# EAGLE design Project a Sketch (EAGLE 5.11)
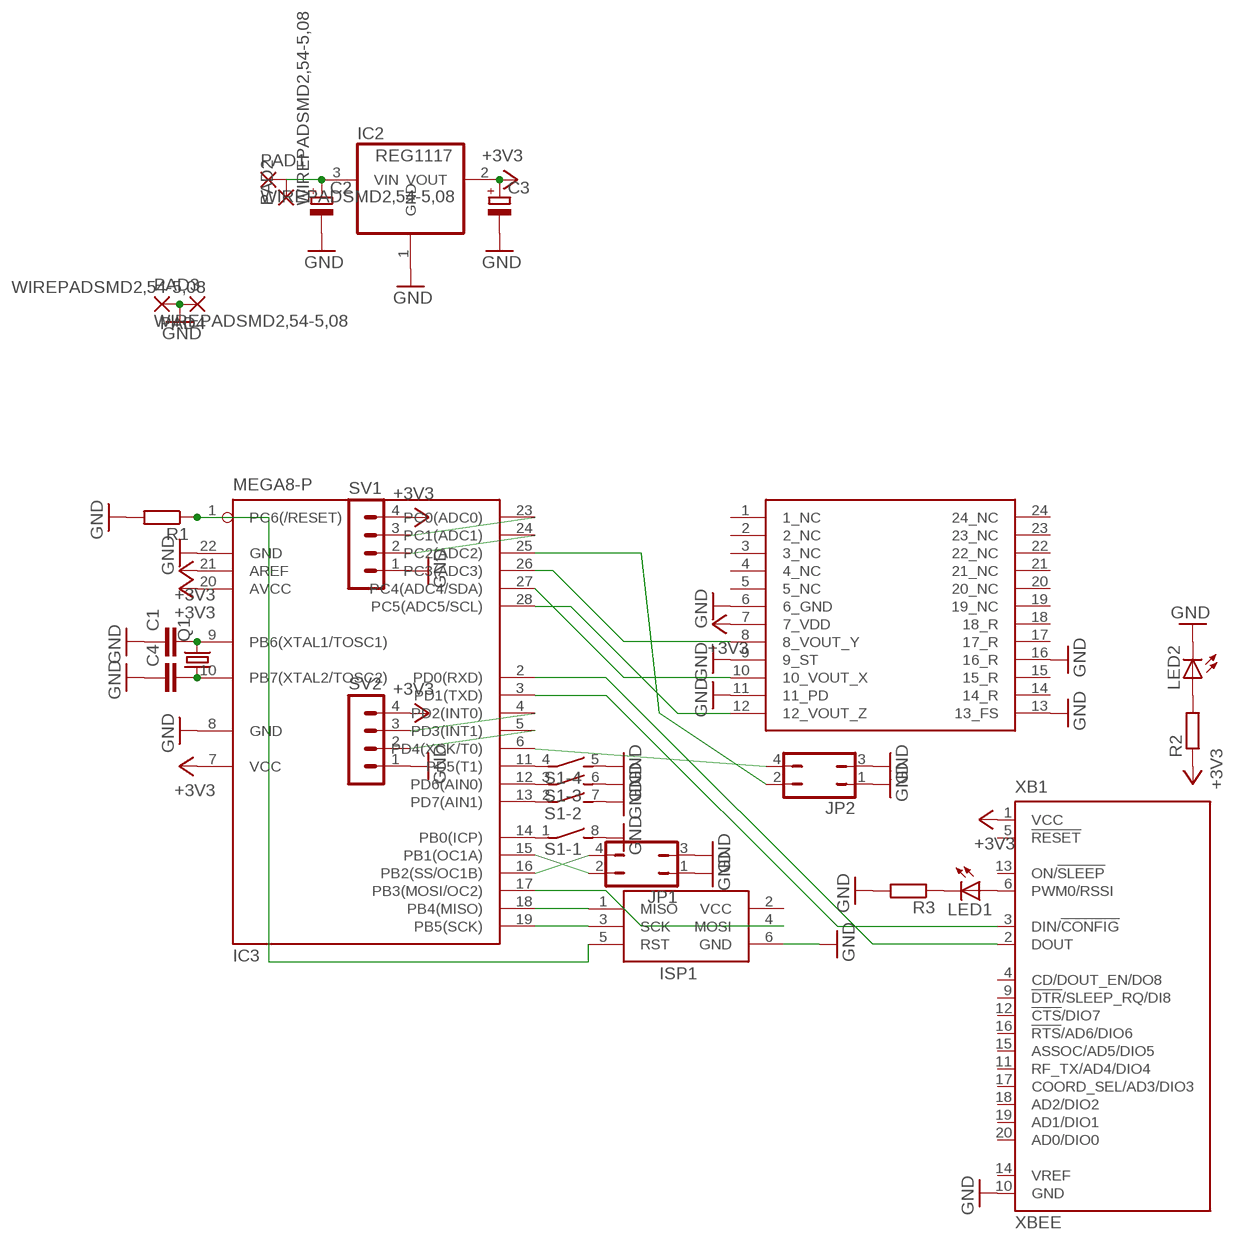
[diagram p0: schematic, sheet 1]

## Parts
C1  C-EUC0805K  [C0805K]
C2  CPOL-EUE5-6  [E5-6]
C3  CPOL-EUE5-6  [E5-6]
C4  C-EUC0805K  [C0805K]
IC2  REG1117  [SOT223]
IC3  MEGA8-P  [DIL28-3]
ISP1  AVRISP-6  [AVRISP]
JP1  JP2Q  [JP2Q]
JP2  JP2Q  [JP2Q]
LED1  LEDCHIPLED_1206  [CHIPLED_1206]
LED2  LEDCHIPLED_1206  [CHIPLED_1206]
PAD1  WIREPADSMD2,54-5,08  [SMD2,54-5,08]
PAD2  WIREPADSMD2,54-5,08  [SMD2,54-5,08]
PAD3  WIREPADSMD2,54-5,08  [SMD2,54-5,08]
PAD4  WIREPADSMD2,54-5,08  [SMD2,54-5,08]
Q1  CRYSTALHC49S  [HC49/S]
R1  R-EU_R0805  [R0805]
R2  R-EU_R0805  [R0805]
R3  R-EU_R0805  [R0805]
S1  DIP04S  [DIP04S]
SV1  MA04-1  [MA04-1]
SV2  MA04-1  [MA04-1]
U$1  LIS3L02AS4  [SO-24]
XB1  XBEE  [XBEE]

## Nets
+3V3: C3.+ IC2.2(VOUT) IC3.7(VCC) IC3.20(AVCC) IC3.21(AREF) R2.1 SV1.4 SV2.4 U$1.7(7_VDD) XB1.1(VCC)
GND: C1.1 C2.- C3.- C4.1 IC2.1(GND) IC3.8(GND) IC3.22(GND) ISP1.6(GND) JP1.1 JP1.3 JP2.1 JP2.3 LED2.C PAD3.1(P) PAD4.1(P) R1.2 R3.2 S1.5 S1.6 S1.7 S1.8 SV1.1 SV2.1 U$1.6(6_GND) U$1.9(9_ST) U$1.11(11_PD) U$1.13(13_FS) U$1.16(16_R) XB1.10(GND)
N$1: IC3.1(PC6(/RESET)) ISP1.5(RST) R1.1
N$2: IC3.18(PB4(MISO)) ISP1.1(MISO)
N$3: IC3.19(PB5(SCK)) ISP1.3(SCK)
N$4: IC3.17(PB3(MOSI/OC2)) ISP1.4(MOSI)
N$5: C1.2 IC3.9(PB6(XTAL1/TOSC1)) Q1.2
N$6: C2.+ IC2.3(VIN) PAD1.1(P) PAD2.1(P)
N$7: IC3.27(PC4(ADC4/SDA)) U$1.10(10_VOUT_X)
N$8: IC3.28(PC5(ADC5/SCL)) U$1.12(12_VOUT_Z)
N$9: IC3.26(PC3(ADC3)) U$1.8(8_VOUT_Y)
N$10: IC3.2(PD0(RXD)) XB1.2(DOUT)
N$11: IC3.3(PD1(TXD)) XB1.3(DIN/!CONFIG)
N$12: IC3.11(PD5(T1)) S1.4
N$13: IC3.13(PD7(AIN1)) S1.2
N$14: IC3.12(PD6(AIN0)) S1.3
N$15: IC3.14(PB0(ICP)) S1.1
N$16: C4.2 IC3.10(PB7(XTAL2/TOSC2)) Q1.1
N$17: IC3.4(PD2(INT0)) SV2.3
N$18: IC3.5(PD3(INT1)) SV2.2
N$19: IC3.23(PC0(ADC0)) SV1.3
N$20: IC3.24(PC1(ADC1)) SV1.2
N$21: IC3.16(PB2(SS/OC1B)) JP1.4
N$22: IC3.15(PB1(OC1A)) JP1.2
N$23: IC3.6(PD4(XCK/T0)) JP2.4
N$24: IC3.25(PC2(ADC2)) JP2.2
N$25: LED1.A XB1.6(PWM0/RSSI)
N$26: LED2.A R2.2
N$27: LED1.C R3.1
Unconnected: U$1.1(1_NC) U$1.2(2_NC) U$1.3(3_NC) U$1.4(4_NC) U$1.5(5_NC) U$1.14(14_R) U$1.15(15_R) U$1.17(17_R) U$1.18(18_R) U$1.19(19_NC) U$1.20(20_NC) U$1.21(21_NC) U$1.22(22_NC) U$1.23(23_NC) U$1.24(24_NC) XB1.4(CD/DOUT_EN/DO8) XB1.5(!RESET) XB1.9(!DTR!/SLEEP_RQ/DI8) XB1.11(RF_TX/AD4/DIO4) XB1.12(!CTS!/DIO7) XB1.13(ON/!SLEEP) XB1.14(VREF) XB1.15(ASSOC/AD5/DIO5) XB1.16(!RTS!/AD6/DIO6) XB1.17(COORD_SEL/AD3/DIO3) XB1.18(AD2/DIO2) XB1.19(AD1/DIO1) XB1.20(AD0/DIO0)

## Power pins joined to a net without a drawn wire
VCC: ISP1.2(VCC)

## Library data of the parts
C1 C4 = rcl:C-EU: CAPACITOR, European symbol
C2 C3 = rcl:CPOL-EU: POLARIZED CAPACITOR, European symbol
IC2 = burr-brown:REG1117: 800mA and 1A Low Dropout (LDO) Positive Regulator 1.8V, 2.5V, 2.85V, 3.3V, 5V, and Adj; MPN: REG1117; OC_FARNELL: 1097566; OC_NEWARK: 14P6981
IC3 = atmel:MEGA8-P: MICROCONTROLLER 8 Kbytes FLASH, 1 kbytes SRAM, 512 bytes EEPROM, USART, 4-channel 10 bit ADC, 2-channel 8 bit ADC Pin compatible with Atmega48, ATMega88, ATMega168 Source: avr.lbr; OC_FARNELL: unknown; OC_NEWARK: unknown
ISP1 = adafruit:AVRISP: AVR ISP HEADER Standard 6 pin header for AVR programming
JP1 JP2 = jumper:JP2Q: JUMPER
LED1 LED2 = led:LED: LED OSRAM: - CHIPLED LG R971, LG N971, LY N971, LG Q971, LY Q971, LO R971, LY R971 LH N974, LH R974 LS Q976, LO Q976, LY Q976 LO Q996 - Hyper CHIPLED LW Q18S LB Q993, LB Q99A, LB R99A - SideLED LS A670, LO A670, LY A670, LG A670, LP A670 LB A673, LV A673, LT A673, LW A673 LH A674 LY A675 LS A676, LA A676, LO A676, LY A676, LW A676 LS A679, LY A679, LG A679 - Hyper Micro SIDELED® LS Y876, LA Y876, LO Y876, LY Y876 LT Y87S - SmartLED LW L88C, LW L88S LB L89C, LB L89S, LG L890 LS L89K, LO L89K, LY L89K LS L896, LA L896, LO L896, LY L896 - TOPLED LS T670, LO T670, LY T670, LG T670, LP T670 LSG T670, LSP T670, LSY T670, LOP T670, LYG T670 LG T671, LOG T671, LSG T671 LB T673, LV T673, LT T673, LW T673 LH T674 LS T676, LA T676, LO T676, LY T676, LB T676, LH T676, LSB T676, LW T676 LB T67C, LV T67C, LT T67C, LS T67K, LO T67K, LY T67K, LW E67C LS E67B, LA E67B, LO E67B, LY E67B, LB E67C, LV E67C, LT E67C LW T67C LS T679, LY T679, LG T679 LS T770, LO T770, LY T770, LG T770, LP T770 LB T773, LV T773, LT T773, LW T773 LH T774 LS E675, LA E675, LY E675, LS T675 LS T776, LA T776, LO T776, LY T776, LB T776 LHGB T686 LT T68C, LB T68C - Hyper Mini TOPLED® LB M676 - Mini TOPLED Santana® LG M470 LS M47K, LO M47K, LY M47K Source: http://www.osram.convergy.de LUXEON: - LUMILED® LXK2-PW12-R00, LXK2-PW12-S00, LXK2-PW14-U00, LXK2-PW14-V00 LXK2-PM12-R00, LXK2-PM12-S00, LXK2-PM14-U00 LXK2-PE12-Q00, LXK2-PE12-R00, LXK2-PE12-S00, LXK2-PE14-T00, LXK2-PE14-U00 LXK2-PB12-K00, LXK2-PB12-L00, LXK2-PB12-M00, LXK2-PB14-N00, LXK2-PB14-P00, LXK2-PB14-Q00 LXK2-PR12-L00, LXK2-PR12-M00, LXK2-PR14-Q00, LXK2-PR14-R00 LXK2-PD12-Q00, LXK2-PD12-R00, LXK2-PD12-S00 LXK2-PH12-R00, LXK2-PH12-S00 LXK2-PL12-P00, LXK2-PL12-Q00, LXK2-PL12-R00 Source: www.luxeon.com KINGBRIGHT: KA-3528ASYC Source: www.kingbright.com
PAD1-PAD4 = wirepad:WIREPAD: Wire PAD connect wire on PCB
Q1 = crystal:CRYSTAL: CRYSTAL; OC_FARNELL: 1667008; OC_NEWARK: unknown
R1-R3 = rcl:R-EU_: RESISTOR, European symbol
S1 = switch-dil:DIP04S: DIL/CODE SWITCH; OC_FARNELL: unknown; OC_NEWARK: unknown
SV1 SV2 = con-lstb:MA04-1: PIN HEADER; OC_FARNELL: unknown; OC_NEWARK: unknown
U$1 = lis3l02as4:LIS3L02AS4: www.st.com 3-axis-accelerometer
XB1 = maxstream:XBEE: XBee (TM) /XBee-PRO(TM) OEM RF Modules Source: MaxStream, Inc. xbee_productmanual.pdf; MPN: XBP24-Z7UIT-004; OC_FARNELL: 1751799; OC_NEWARK: 34R5507

## Board
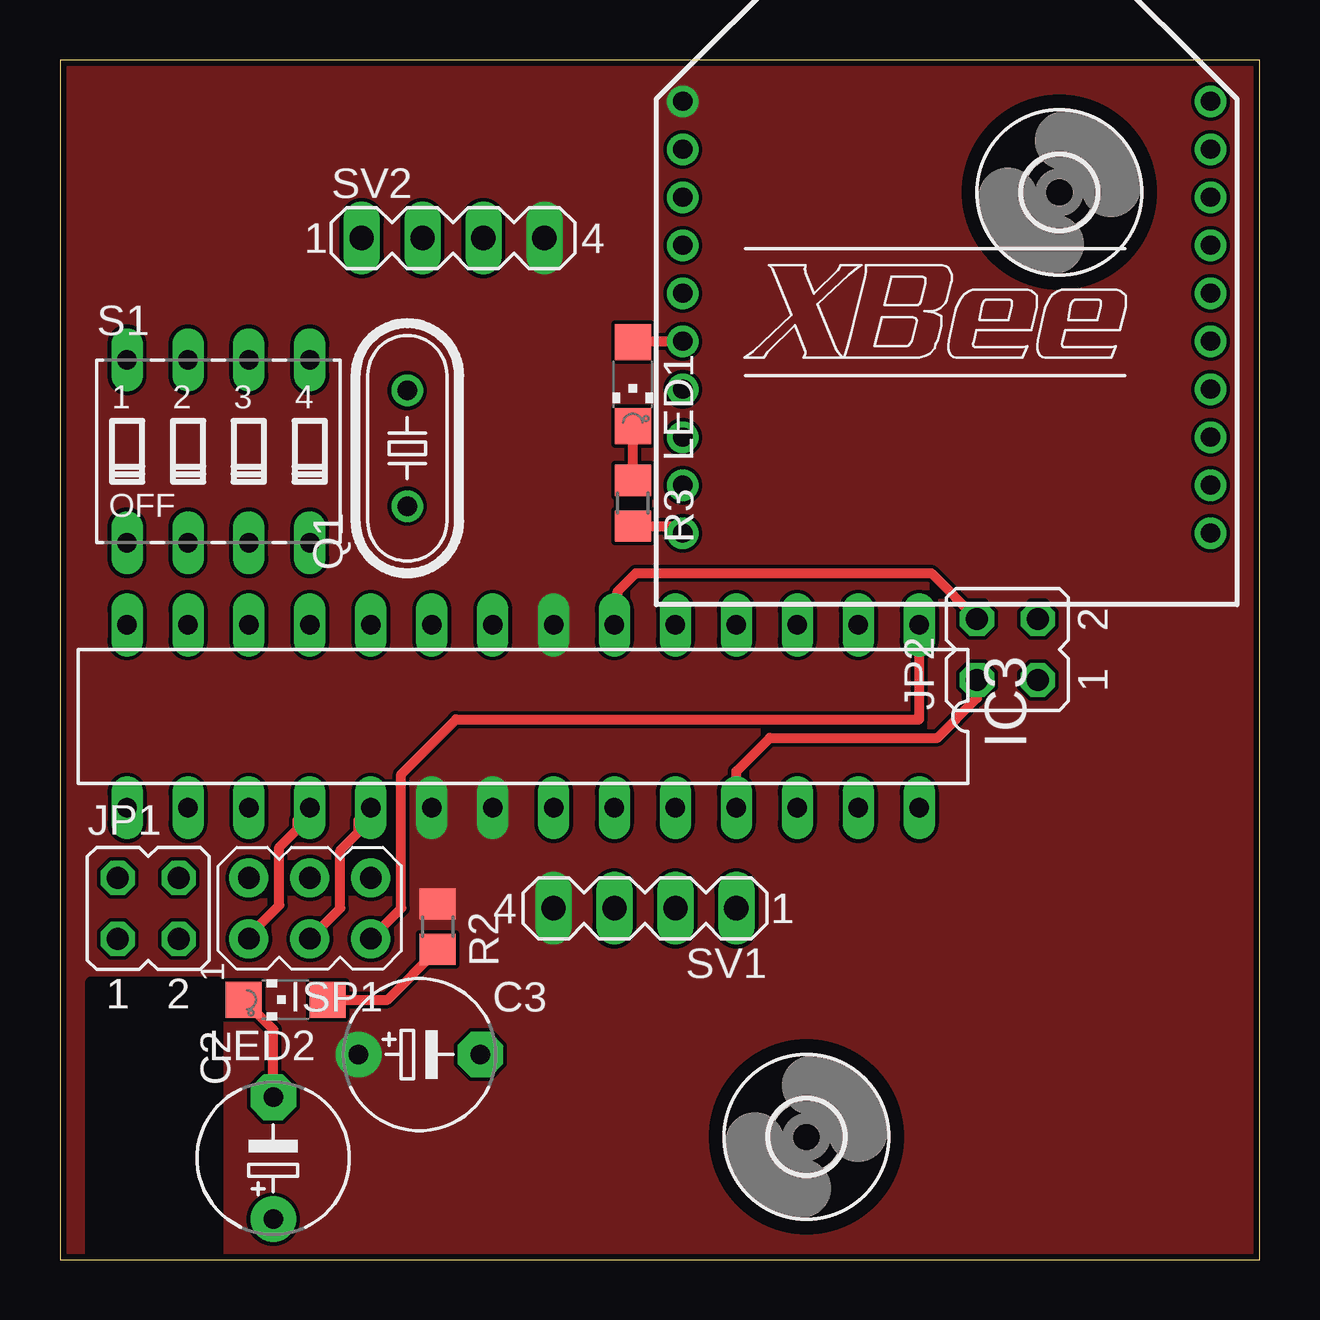
[diagram p1: board, top side]
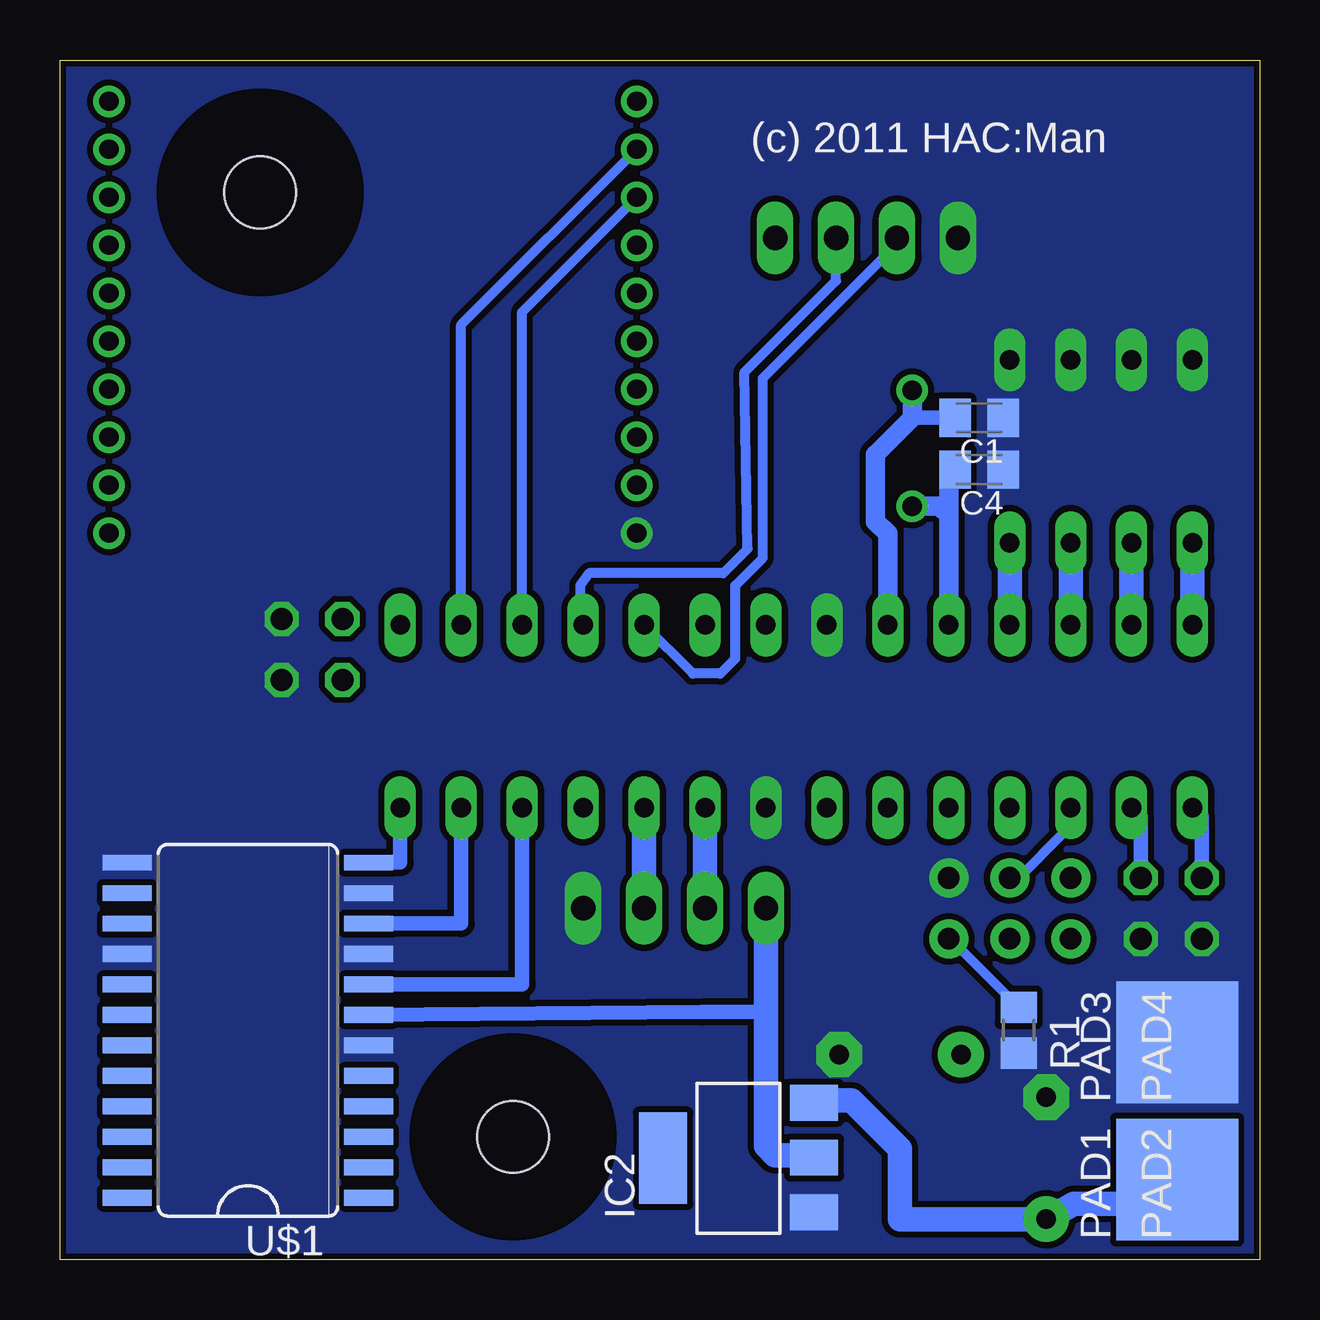
[diagram p2: board, bottom side, seen from below]

Size 50 x 50 mm. Coordinates in mm from the lower left corner, seen from the top.
Outline: 0,0 50,0 50,50 0,50 0,0
Copper layers (1*16): Top 0.035mm / dielectric 1.5mm / Bottom 0.035mm
Design rules "Seeed Fusion Design Rules": minimum track width 6mil, minimum drill 12mil, track to track 6mil, track to pad 6mil, pad to pad 6mil, via to via 6mil, smd to smd 0mil, copper to edge 10mil, drill to drill 10mil, minimum pad ring 10mil, minimum via ring 6mil, stop-mask expansion 2mil, vias tented up to drill 100mil, thermal gap 10mil
tRestrict: area 1.3,0.2 to 6.6,11.6

### Footprints (pad centres in the part's own frame; a part is rotated, then mirrored left to right if it is on the bottom)
C0805K = smd 1.3 x 1.6: 1 -1,0; 2 1,0
E5-6 = drill 0.813 pad 1.905 round: + -2.54,0 | drill 0.813 pad 1.905 octagon: - 2.54,0
SOT223 = smd 1.499 x 2.007: 1 -2.261,-3.15; 2 0.025,-3.15; 3 2.311,-3.15 | smd 3.81 x 2.007: 4 0,3.15
DIL28-3 = drill 0.813 long: 1 -16.51,-3.81; 2 -13.97,-3.81; 3 -11.43,-3.81; 4 -8.89,-3.81; 5 -6.35,-3.81; 6 -3.81,-3.81; 7 -1.27,-3.81; 8 1.27,-3.81; 9 3.81,-3.81; 10 6.35,-3.81; 11 8.89,-3.81; 12 11.43,-3.81; 13 13.97,-3.81; 14 16.51,-3.81; 15 16.51,3.81; 16 13.97,3.81; 17 11.43,3.81; 18 8.89,3.81; 19 6.35,3.81; 20 3.81,3.81; 21 1.27,3.81; 22 -1.27,3.81; 23 -3.81,3.81; 24 -6.35,3.81; 25 -8.89,3.81; 26 -11.43,3.81; 27 -13.97,3.81; 28 -16.51,3.81
AVRISP = drill 0.9 pad 1.626 round: 1 -1.27,2.54; 2 1.27,2.54; 3 -1.27,0; 4 1.27,0; 5 -1.27,-2.54; 6 1.27,-2.54
JP2Q = drill 0.914 octagon: 1 -1.27,-1.27; 2 -1.27,1.27; 3 1.27,-1.27; 4 1.27,1.27
CHIPLED_1206 = smd 1.5 x 1.5: A 0,-1.75; C 0,1.75
SMD2,54-5,08 = smd 2.54 x 5.08: 1 0,0
HC49/S = drill 0.813 round: 1 -2.413,0; 2 2.413,0
R0805 = smd 1.3 x 1.5: 1 -0.95,0; 2 0.95,0
DIP04S = drill 0.813 long: 1 -3.81,-3.81; 2 -1.27,-3.81; 3 1.27,-3.81; 4 3.81,-3.81; 5 3.81,3.81; 6 1.27,3.81; 7 -1.27,3.81; 8 -3.81,3.81
MA04-1 = drill 1.016 long: 1 -3.81,0; 2 -1.27,0; 3 1.27,0; 4 3.81,0
SO-24 = smd 0.66 x 2.032: 1 -9.779,-4.013; 2 -8.509,-4.013; 3 -7.239,-4.013; 4 -5.969,-4.013; 5 -4.699,-4.013; 6 -3.429,-4.013; 7 -2.159,-4.013; 8 -0.889,-4.013; 9 0.381,-4.013; 10 1.651,-4.013; 11 2.921,-4.013; 12 4.191,-4.013; 13 4.191,6.045; 14 2.921,6.045; 15 1.651,6.045; 16 0.381,6.045; 17 -0.889,6.045; 18 -2.159,6.045; 19 -3.429,6.045; 20 -4.699,6.045; 21 -5.969,6.045; 22 -7.239,6.045; 23 -8.509,6.045; 24 -9.779,6.045
3,0 = hole 3: 0,0
XBEE = drill 0.8 pad 1.27 round: 1 -11,9; 2 -11,7; 3 -11,5; 4 -11,3; 5 -11,1; 6 -11,-1; 7 -11,-3; 8 -11,-5; 9 -11,-7; 10 -11,-9; 11 11,-9; 12 11,-7; 13 11,-5; 14 11,-3; 15 11,-1; 16 11,1; 17 11,3; 18 11,5; 19 11,7; 20 11,9

### Placement (x,y rotation side)
C1  11.68,35.09 180 bottom
C2  8.89,4.22 90 top
C3  14.99,8.54 0 top
C4  11.68,32.93 180 bottom
IC2  21.72,4.22 90 bottom
IC3  19.3,22.64 180 top
ISP1  10.41,14.64 90 top
JP1  3.68,14.64 0 top
JP2  39.5,25.43 90 top
LED1  23.88,36.48 180 top
LED2  9.4,10.83 90 top
PAD1  4.7,3.34 0 bottom
PAD2  2.16,3.34 0 bottom
PAD3  4.7,9.05 0 bottom
PAD4  2.16,9.05 0 bottom
Q1  14.48,33.81 90 top
R1  10.03,9.56 270 bottom
R2  15.75,13.88 270 top
R3  23.88,31.53 270 top
S1  6.6,33.69 0 top
SV1  24.38,14.64 180 top
SV2  16.38,42.58 0 top
U$1  41.15,12.35 90 bottom
U$2  [3,0]  41.66,44.48 0 top
U$3  [3,0]  31.11,5.11 0 top
XB1  36.96,39.28 0 top

### Tracks (layer width: path | path; a pad name or v marks a point on that pad's centre or on a via)
+3V3
  Bottom 0.61: U$1.7 23.24,10.32 20.57,10.32
  Bottom 1.016: IC2.2 18.67,4.35 20.19,4.35 20.57,4.73 20.57,10.32 SV1.4
  pour Top (no thermals): -2.54,55.02 50.8,55.02 50.8,-12.79 -2.54,-12.79 -2.54,54.77
GND
  Top 0.406: LED2.C 8.89,9.59 C2.- | R3.2 25.65,30.58 XB1.10
  pour Bottom (isolate 0.254, no thermals): -0.25,-12.79 50.42,-12.79 50.42,70.64 -0.25,70.64
N$1
  Top 0.406: IC3.1 35.81,22.51 16.51,22.51 14.22,20.23 14.22,14.64 ISP1.5
  Bottom 0.406: ISP1.5 12.89,13.37 R1.1
N$2
  Top 0.406: IC3.18 9.91,18.32 9.91,17.94 9.14,17.18 9.14,14.77 7.87,13.5 ISP1.1
N$3
  Top 0.406: IC3.19 12.45,18.32 12.45,17.81 11.68,17.05 11.68,14.64 ISP1.3
N$4
  Bottom 0.406: IC3.17 8.13,18.57 8.13,17.81 10.03,15.91 ISP1.4
N$5
  Bottom 0.61: 14.48,35.09 C1.2
  Bottom 0.813: IC3.9 15.49,30.26 16,30.77 16,33.56 14.48,35.09 Q1.2
N$6
  Bottom 1.016: 4.19,3.34 5.21,2.32 7.75,2.32 C2.+ 14.99,1.68 14.99,4.61 17.02,6.64 18.47,6.64 IC2.3
  Bottom 1.422: PAD2.1 4.19,3.34 PAD1.1 4.32,2.7
N$7
  Bottom 0.61: IC3.27 33.27,14 U$1.10
N$8
  Bottom 0.61: IC3.28 35.81,16.54 U$1.12
N$9
  Bottom 0.61: IC3.26 30.73,11.46 U$1.8
N$10
  Bottom 0.406: XB1.2 33.27,38.96 IC3.2
N$11
  Bottom 0.406: XB1.3 30.73,39.5 IC3.3
N$12
  Bottom 1.016: IC3.11 S1.4
N$13
  Bottom 1.016: IC3.13 S1.2
N$14
  Bottom 1.016: IC3.12 S1.3
N$15
  Bottom 1.016: IC3.14 S1.1
N$16
  Bottom 0.813: Q1.1 13.34,31.4 12.95,31.02 | IC3.10 12.95,31.02 | C4.2 12.95,32.93 12.95,31.02
N$17
  Bottom 0.406: IC3.4 28.32,26.58 28.32,28.1 27.94,28.61 22.35,28.61 21.34,29.62 21.46,36.99 17.65,40.8 SV2.3
N$18
  Bottom 0.406: SV2.2 15.11,42.32 20.7,36.74 20.7,29.24 21.84,28.1 21.84,25.05 22.48,24.42 23.62,24.42 IC3.5
N$19
  Bottom 1.016: SV1.3 IC3.23
N$20
  Bottom 1.016: SV1.2 IC3.24
N$21
  Bottom 0.61: IC3.16 4.95,18.45 JP1.4
N$22
  Bottom 0.61: IC3.15 2.41,18.45 JP1.2
N$23
  Top 0.406: IC3.6 23.24,26.58 23.24,27.85 24,28.61 36.32,28.61 JP2.4
N$24
  Top 0.406: IC3.25 28.19,20.35 29.59,21.75 36.58,21.75 38.23,23.4 JP2.2
N$25
  Top 0.406: XB1.6 23.92,38.28 LED1.A
N$26
  Top 0.406: LED2.A 13.65,10.83 R2.2
N$27
  Top 0.406: R3.1 LED1.C

### Text on the board
tSilk: 1 | FLIP | L/R | U/D | QUAD2 | OK | Project-a-sketch 2.0 | 1 | B3 | B4 | B1 | B2 | QUAD1 | + | - | - | http://hacman.org.uk | http://thinkl33t.co.uk | +
bSilk: (c) 2011 HAC:Man